# EAGLE design v.0.0.1 (EAGLE 5.11)

## Sheet 1 of 4
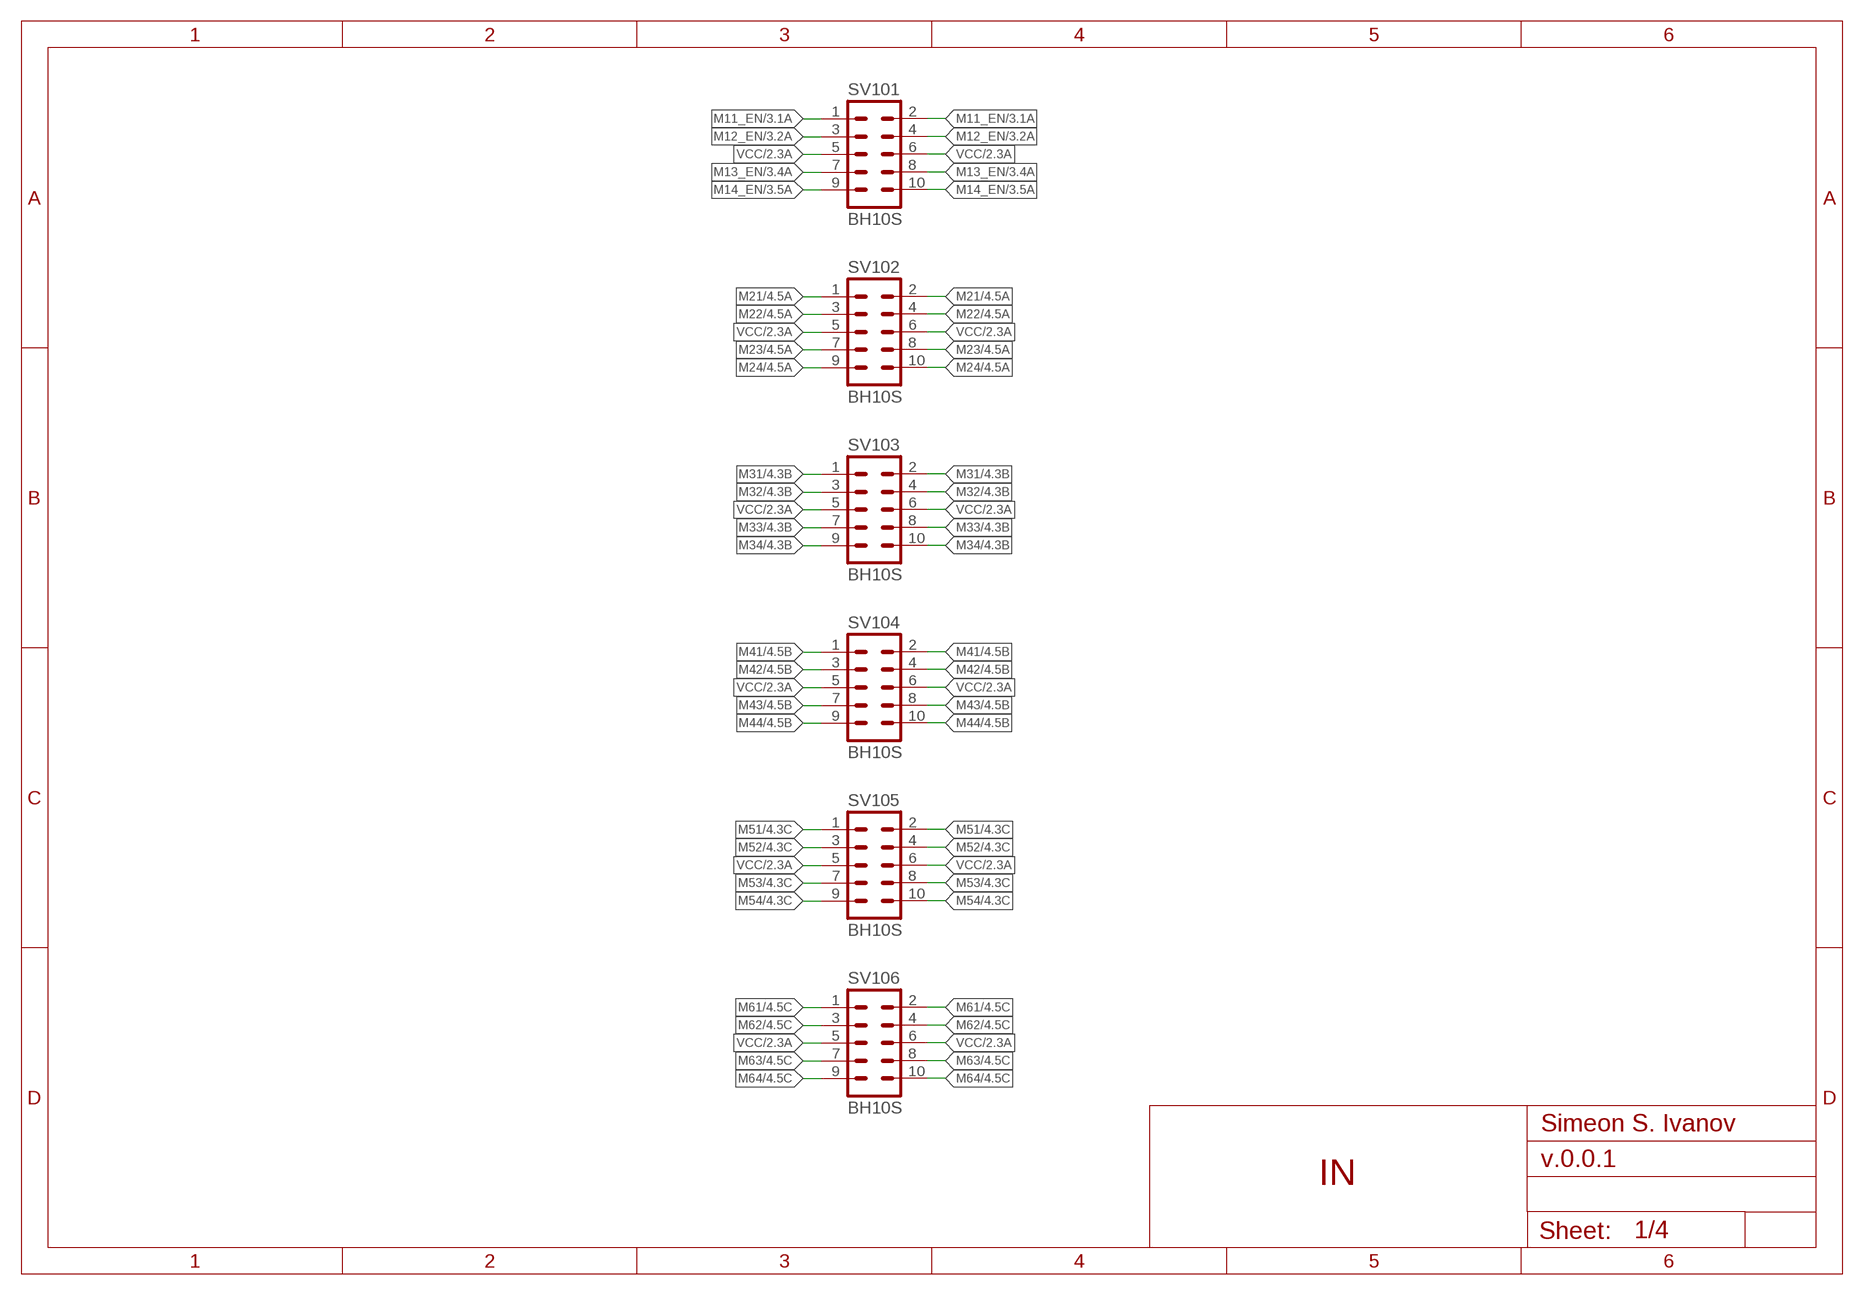
[diagram p0: schematic, sheet 1]

### Parts
SV101  BH10S  ML10M10-HOME  [M10-HOME]
SV102  BH10S  ML10M10-HOME  [M10-HOME]
SV103  BH10S  ML10M10-HOME  [M10-HOME]
SV104  BH10S  ML10M10-HOME  [M10-HOME]
SV105  BH10S  ML10M10-HOME  [M10-HOME]
SV106  BH10S  ML10M10-HOME  [M10-HOME]

### Nets
M11_EN: SV101.1 SV101.2 ; also sheet 3
M12_EN: SV101.3 SV101.4 ; also sheet 3
M13_EN: SV101.7 SV101.8 ; also sheet 3
M14_EN: SV101.9 SV101.10 ; also sheet 3
M21: SV102.1 SV102.2 ; also sheet 4
M22: SV102.3 SV102.4 ; also sheet 4
M23: SV102.7 SV102.8 ; also sheet 4
M24: SV102.9 SV102.10 ; also sheet 4
M31: SV103.1 SV103.2 ; also sheet 4
M32: SV103.3 SV103.4 ; also sheet 4
M33: SV103.7 SV103.8 ; also sheet 4
M34: SV103.9 SV103.10 ; also sheet 4
M41: SV104.1 SV104.2 ; also sheet 4
M42: SV104.3 SV104.4 ; also sheet 4
M43: SV104.7 SV104.8 ; also sheet 4
M44: SV104.9 SV104.10 ; also sheet 4
M51: SV105.1 SV105.2 ; also sheet 4
M52: SV105.3 SV105.4 ; also sheet 4
M53: SV105.7 SV105.8 ; also sheet 4
M54: SV105.9 SV105.10 ; also sheet 4
M61: SV106.1 SV106.2 ; also sheet 4
M62: SV106.3 SV106.4 ; also sheet 4
M63: SV106.7 SV106.8 ; also sheet 4
M64: SV106.9 SV106.10 ; also sheet 4
VCC: SV101.5 SV101.6 SV102.5 SV102.6 SV103.5 SV103.6 SV104.5 SV104.6 SV105.5 SV105.6 SV106.5 SV106.6 ; also sheet 2

### Notes on the sheet
- Simeon S. Ivanov
- IN

## Sheet 2 of 4
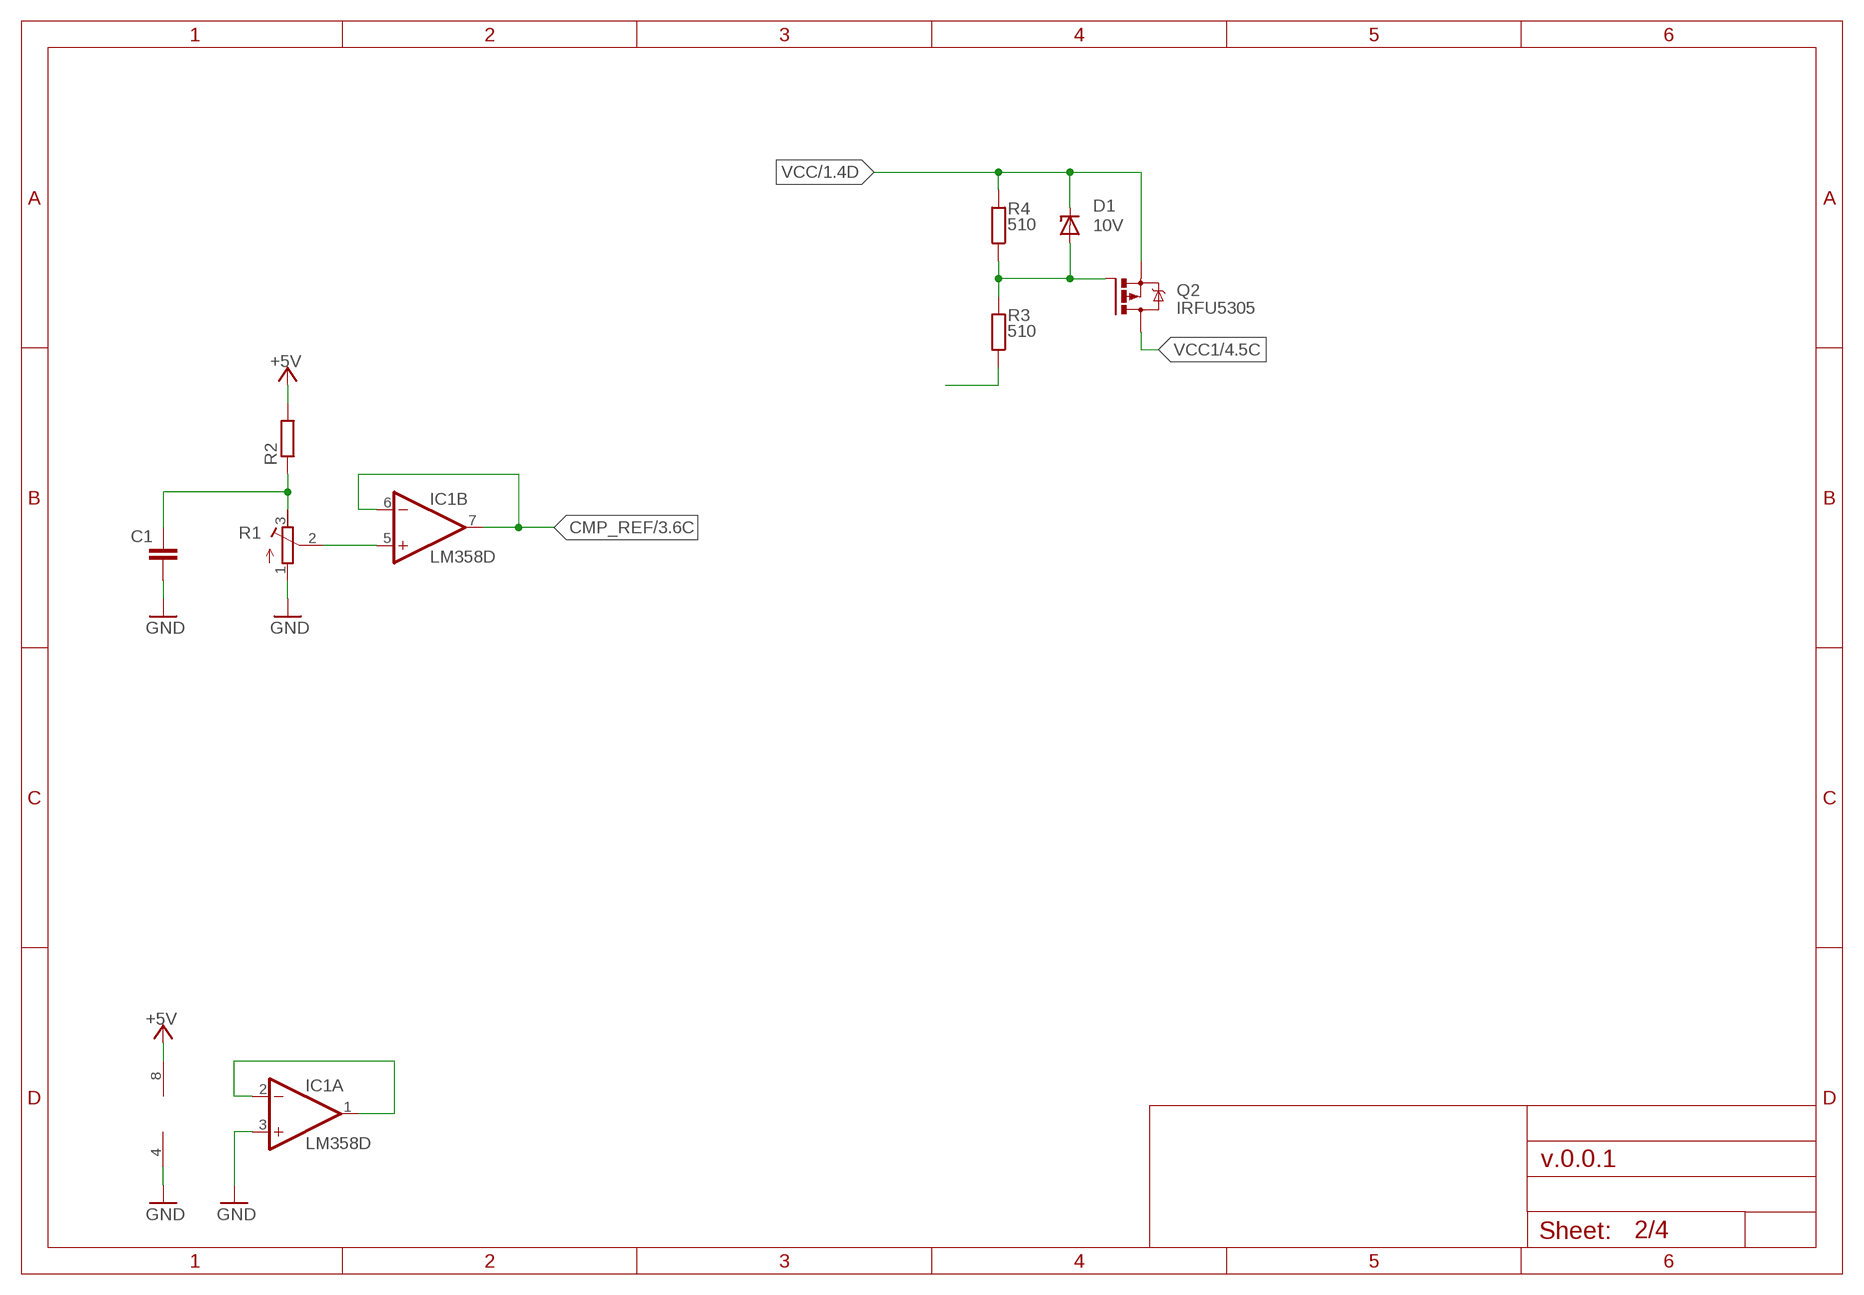
[diagram p1: schematic, sheet 2]

### Parts
C1  C-EUC1206  [C1206]
D1  10V  ZENER-DIODEZD-5  [ZDIO-5]
IC1  LM358D  [SO08]
Q2  IRFU5305  [I-PAK_TO251AA]
R1  R-TRIMM3296W  [RTRIM3296W]
R2  R-EU_0204/5  [0204/5]
R3  510  R-EU_0204/5  [0204/5]
R4  510  R-EU_0204/5  [0204/5]

### Nets
+5V: IC1.8(P:V+) R2.2 ; also sheet 3
CMP_REF: IC1.6(B:-IN) IC1.7(B:OUT) ; also sheet 3
GND: C1.2 IC1.3(A:+IN) IC1.4(P:V-) R1.1(E) ; also sheet 3,4
N$6: C1.1 R1.3(A) R2.1
N$17: IC1.5(B:+IN) R1.2(S)
N$18: IC1.1(A:OUT) IC1.2(A:-IN)
N$23: D1.A Q2.1(G) R3.2 R4.1
N$24: R3.1
VCC: D1.C Q2.3(S) R4.2 ; also sheet 1
VCC1: Q2.2(D) ; also sheet 4

## Sheet 3 of 4
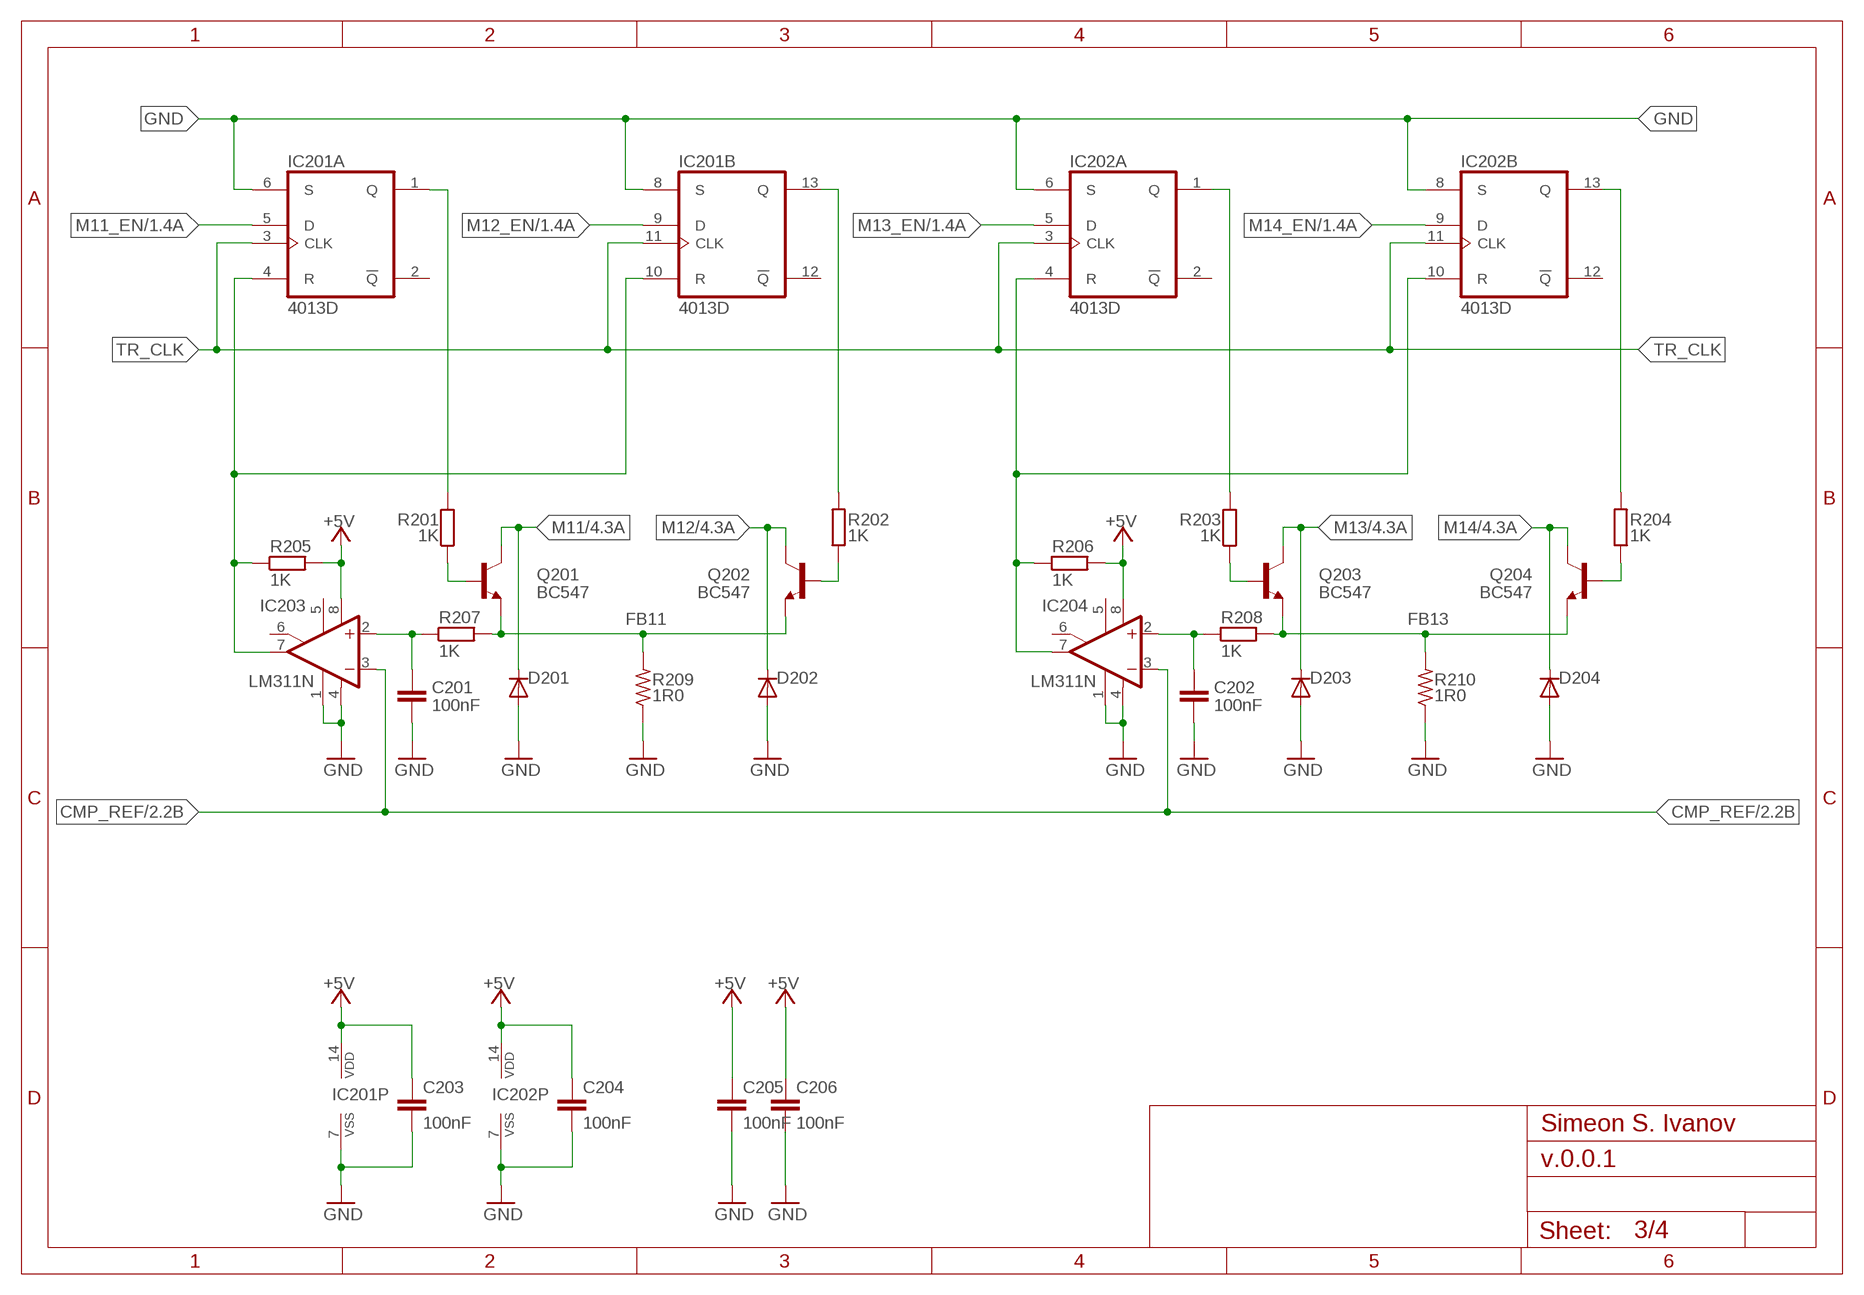
[diagram p2: schematic, sheet 3]

### Parts
C201  100nF  C-EUC1206  [C1206]
C202  100nF  C-EUC1206  [C1206]
C203  100nF  C-EUC0603  [C0603]
C204  100nF  C-EUC0603  [C0603]
C205  100nF  C-EUC0603  [C0603]
C206  100nF  C-EUC0603  [C0603]
D201  DIODE-D-7.5  [D-7.5]
D202  DIODE-D-2.5  [D-2.5]
D203  DIODE-D-5  [D-5]
D204  DIODE-D-5  [D-5]
IC201  4013D  [SO14]
IC202  4013D  [SO14]
IC203  LM311N  [DIL08]
IC204  LM311N  [DIL08]
Q201  BC547  [TO92]
Q202  BC547  [TO92]
Q203  BC547  [TO92]
Q204  BC547  [TO92]
R201  1K  R-EU_0204/5  [0204/5]
R202  1K  R-EU_0204/5  [0204/5]
R203  1K  R-EU_0204/5  [0204/5]
R204  1K  R-EU_0204/5  [0204/5]
R205  1K  R-EU_R0603  [R0603]
R206  1K  R-EU_R0603  [R0603]
R207  1K  R-EU_0204/5  [0204/5]
R208  1K  R-EU_0204/2V  [0204V]
R209  1R0  R-US_0204/5  [0204/5]
R210  1R0  R-US_0204/5  [0204/5]

### Nets
+5V: C203.1 C204.1 C205.1 C206.1 IC201.14(P:VDD) IC202.14(P:VDD) IC203.8(V+) IC204.8(V+) R205.2 R206.2 ; also sheet 2
CMP_REF: IC203.3(-IN) IC204.3(-IN) ; also sheet 2
FB11: Q201.1(E) Q202.1(E) R207.2 R209.2
FB13: Q203.1(E) Q204.1(E) R208.2 R210.2
GND: C201.2 C202.2 C203.2 C204.2 C205.2 C206.2 D201.A D202.A D203.A D204.A IC201.6(A:S) IC201.7(P:VSS) IC201.8(B:S) IC202.6(A:S) IC202.7(P:VSS) IC202.8(B:S) IC203.1(GND) IC203.4(V-) IC204.1(GND) IC204.4(V-) R209.1 R210.1 ; also sheet 2,4
M11: D201.C Q201.3(C) ; also sheet 4
M11_EN: IC201.5(A:D) ; also sheet 1
M12: D202.C Q202.3(C) ; also sheet 4
M12_EN: IC201.9(B:D) ; also sheet 1
M13: D203.C Q203.3(C) ; also sheet 4
M13_EN: IC202.5(A:D) ; also sheet 1
M14: D204.C Q204.3(C) ; also sheet 4
M14_EN: IC202.9(B:D) ; also sheet 1
N$7: Q201.2(B) R201.1
N$8: IC201.13(B:Q) R202.2
N$9: IC201.1(A:Q) R201.2
N$10: IC201.4(A:R) IC201.10(B:R) IC203.7(OUT) R205.1
N$11: Q202.2(B) R202.1
N$12: Q204.2(B) R204.1
N$13: Q203.2(B) R203.1
N$14: IC202.13(B:Q) R204.2
N$15: IC202.4(A:R) IC202.10(B:R) IC204.7(OUT) R206.1
N$16: IC202.1(A:Q) R203.2
N$19: C202.1 IC204.2(+IN) R208.1
N$22: C201.1 IC203.2(+IN) R207.1
TR_CLK: IC201.3(A:CLK) IC201.11(B:CLK) IC202.3(A:CLK) IC202.11(B:CLK)
Unconnected: IC201.2(A:!Q) IC201.12(B:!Q) IC202.2(A:!Q) IC202.12(B:!Q) IC203.5(ON) IC203.6(ON/STR) IC204.5(ON) IC204.6(ON/STR)

### Notes on the sheet
- Simeon S. Ivanov

## Sheet 4 of 4
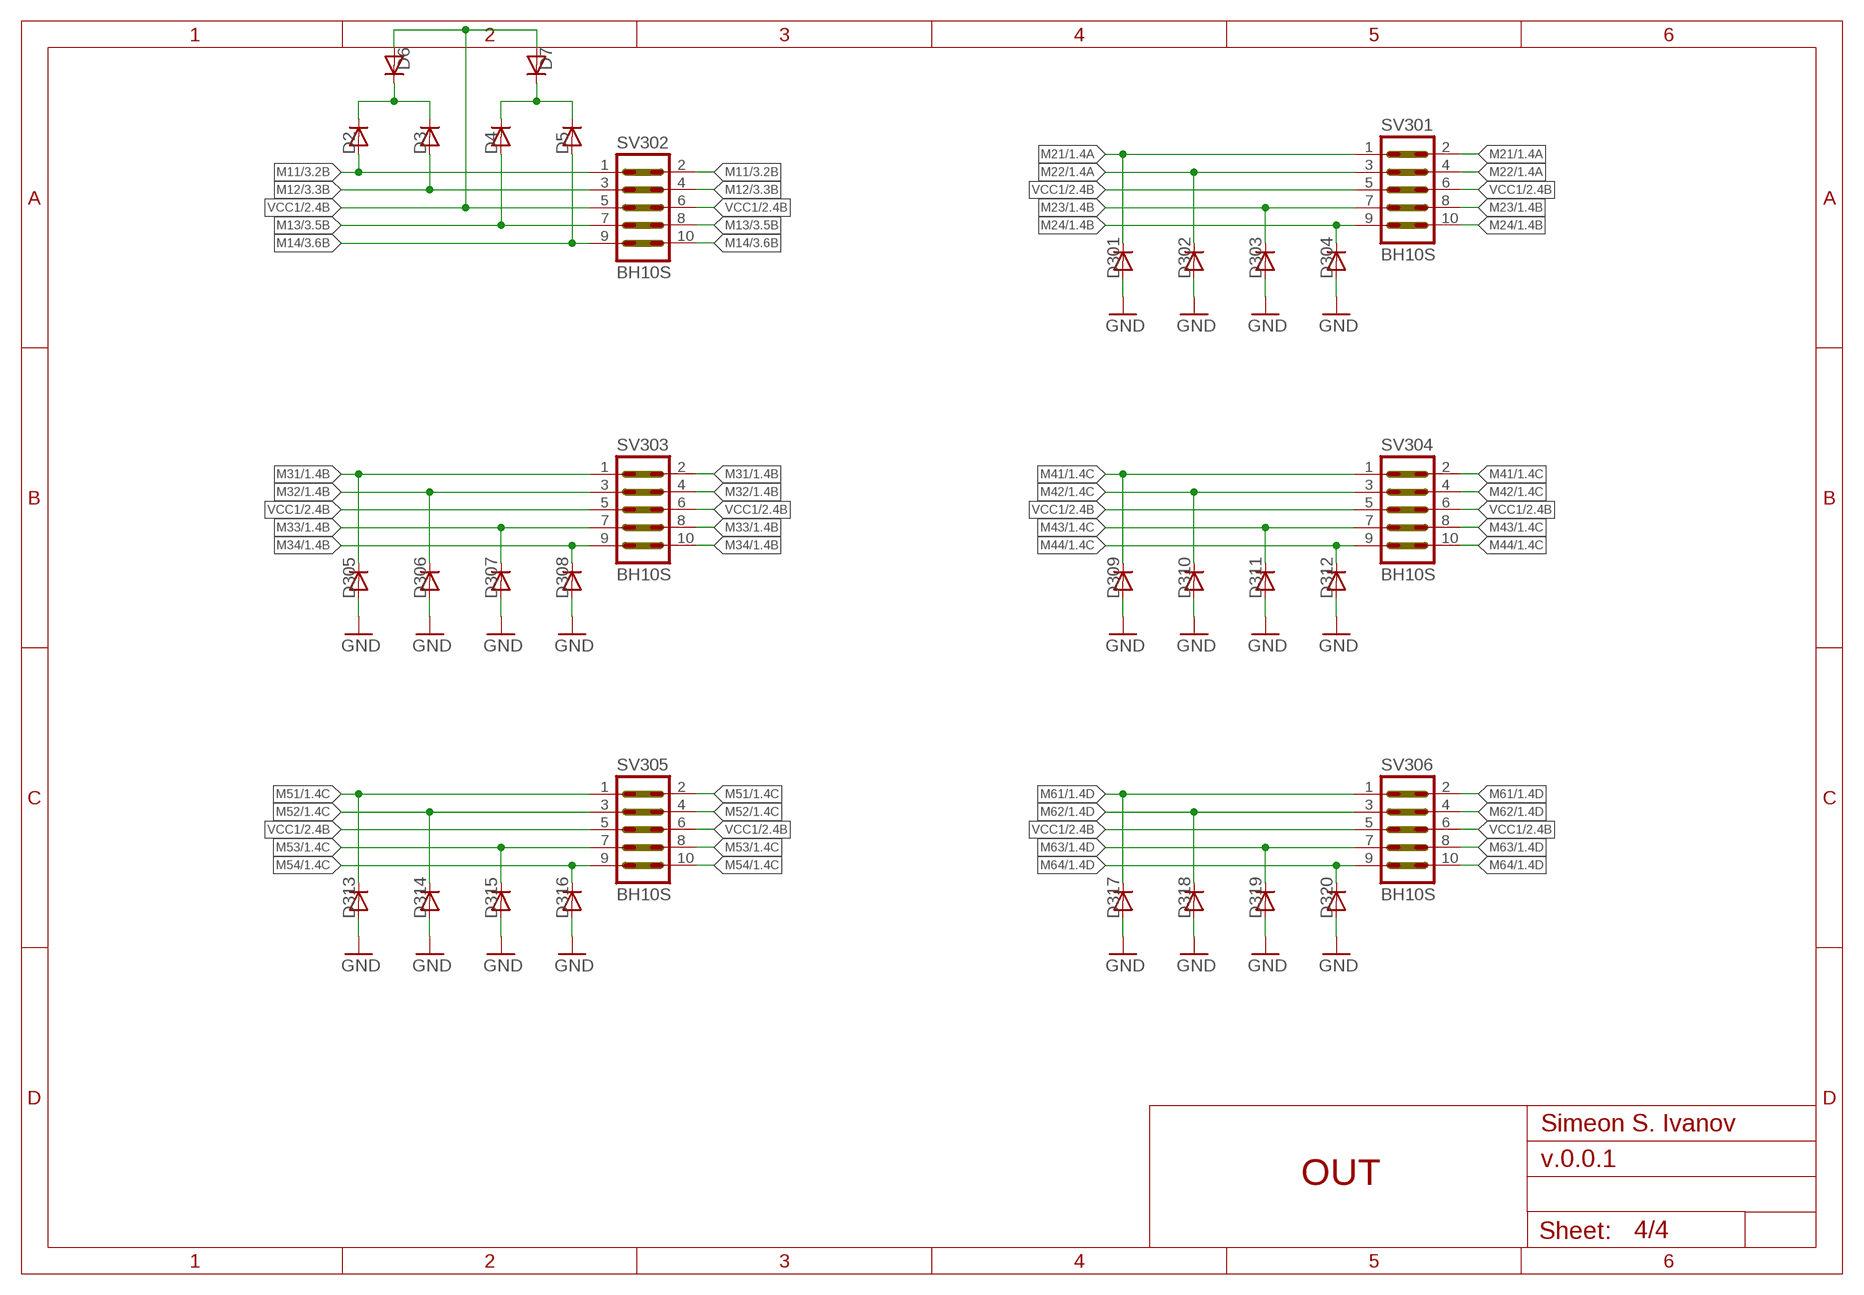
[diagram p3: schematic, sheet 4]

### Parts
D2  DIODE-D-2.5  [D-2.5]
D3  DIODE-D-2.5  [D-2.5]
D4  DIODE-D-2.5  [D-2.5]
D5  DIODE-D-2.5  [D-2.5]
D6  DIODE-D-2.5  [D-2.5]
D7  DIODE-D-2.5  [D-2.5]
D301  DIODE-D-2.5  [D-2.5]
D302  DIODE-D-2.5  [D-2.5]
D303  DIODE-D-2.5  [D-2.5]
D304  DIODE-D-2.5  [D-2.5]
D305  DIODE-D-2.5  [D-2.5]
D306  DIODE-D-2.5  [D-2.5]
D307  DIODE-D-2.5  [D-2.5]
D308  DIODE-D-2.5  [D-2.5]
D309  DIODE-D-2.5  [D-2.5]
D310  DIODE-D-2.5  [D-2.5]
D311  DIODE-D-2.5  [D-2.5]
D312  DIODE-D-2.5  [D-2.5]
D313  DIODE-D-2.5  [D-2.5]
D314  DIODE-D-2.5  [D-2.5]
D315  DIODE-D-2.5  [D-2.5]
D316  DIODE-D-2.5  [D-2.5]
D317  DIODE-D-2.5  [D-2.5]
D318  DIODE-D-2.5  [D-2.5]
D319  DIODE-D-2.5  [D-2.5]
D320  DIODE-D-2.5  [D-2.5]
SV301  BH10S  ML10M10-HOME  [M10-HOME]
SV302  BH10S  ML10M10-HOME  [M10-HOME]
SV303  BH10S  ML10M10-HOME  [M10-HOME]
SV304  BH10S  ML10M10-HOME  [M10-HOME]
SV305  BH10S  ML10M10-HOME  [M10-HOME]
SV306  BH10S  ML10M10-HOME  [M10-HOME]

### Nets
GND: D301.A D302.A D303.A D304.A D305.A D306.A D307.A D308.A D309.A D310.A D311.A D312.A D313.A D314.A D315.A D316.A D317.A D318.A D319.A D320.A ; also sheet 2,3
M11: D2.A SV302.1 SV302.2 ; also sheet 3
M12: D3.A SV302.3 SV302.4 ; also sheet 3
M13: D4.A SV302.7 SV302.8 ; also sheet 3
M14: D5.A SV302.9 SV302.10 ; also sheet 3
M21: D301.C SV301.1 SV301.2 ; also sheet 1
M22: D302.C SV301.3 SV301.4 ; also sheet 1
M23: D303.C SV301.7 SV301.8 ; also sheet 1
M24: D304.C SV301.9 SV301.10 ; also sheet 1
M31: D305.C SV303.1 SV303.2 ; also sheet 1
M32: D306.C SV303.3 SV303.4 ; also sheet 1
M33: D307.C SV303.7 SV303.8 ; also sheet 1
M34: D308.C SV303.9 SV303.10 ; also sheet 1
M41: D309.C SV304.1 SV304.2 ; also sheet 1
M42: D310.C SV304.3 SV304.4 ; also sheet 1
M43: D311.C SV304.7 SV304.8 ; also sheet 1
M44: D312.C SV304.9 SV304.10 ; also sheet 1
M51: D313.C SV305.1 SV305.2 ; also sheet 1
M52: D314.C SV305.3 SV305.4 ; also sheet 1
M53: D315.C SV305.7 SV305.8 ; also sheet 1
M54: D316.C SV305.9 SV305.10 ; also sheet 1
M61: D317.C SV306.1 SV306.2 ; also sheet 1
M62: D318.C SV306.3 SV306.4 ; also sheet 1
M63: D319.C SV306.7 SV306.8 ; also sheet 1
M64: D320.C SV306.9 SV306.10 ; also sheet 1
N$20: D2.C D3.C D6.C
N$25: D4.C D5.C D7.C
VCC1: D6.A D7.A SV301.5 SV301.6 SV302.5 SV302.6 SV303.5 SV303.6 SV304.5 SV304.6 SV305.5 SV305.6 SV306.5 SV306.6 ; also sheet 2

### Notes on the sheet
- Simeon S. Ivanov
- OUT

## Library data of the parts
C1 C201-C206 = rcl:C-EU: CAPACITOR, European symbol
D1 = diode:ZENER-DIODE: Z-Diode
D2-D7 D201-D204 D301-D320 = diode:DIODE-: DIODE
IC1 = linear:LM358: OP AMP also LM158; LM258; LM2904 Source: http://cache.national.com/ds/LM/LM158.pdf
IC201 IC202 = 40xx:4013: Dual D FLIP FLOP, set/reset
IC203 IC204 = linear:LM311: COMPARATOR
Q2 = transistor-power:IRF?5305: HEXFET Power MOSFET Source: http://www.irf.com/product-info/datasheets/data/irfr5305pbf.pdf
Q201-Q204 = transistor-npn:BC547*: NPN Transistor
R1 = rcl:R-TRIMM: Trimm resistor
R2-R4 R201-R208 = rcl:R-EU_: RESISTOR, European symbol
R209 R210 = rcl:R-US_: RESISTOR, American symbol
SV101-SV106 SV301-SV306 = con-harting-ml:ML10: HARTING

## Board
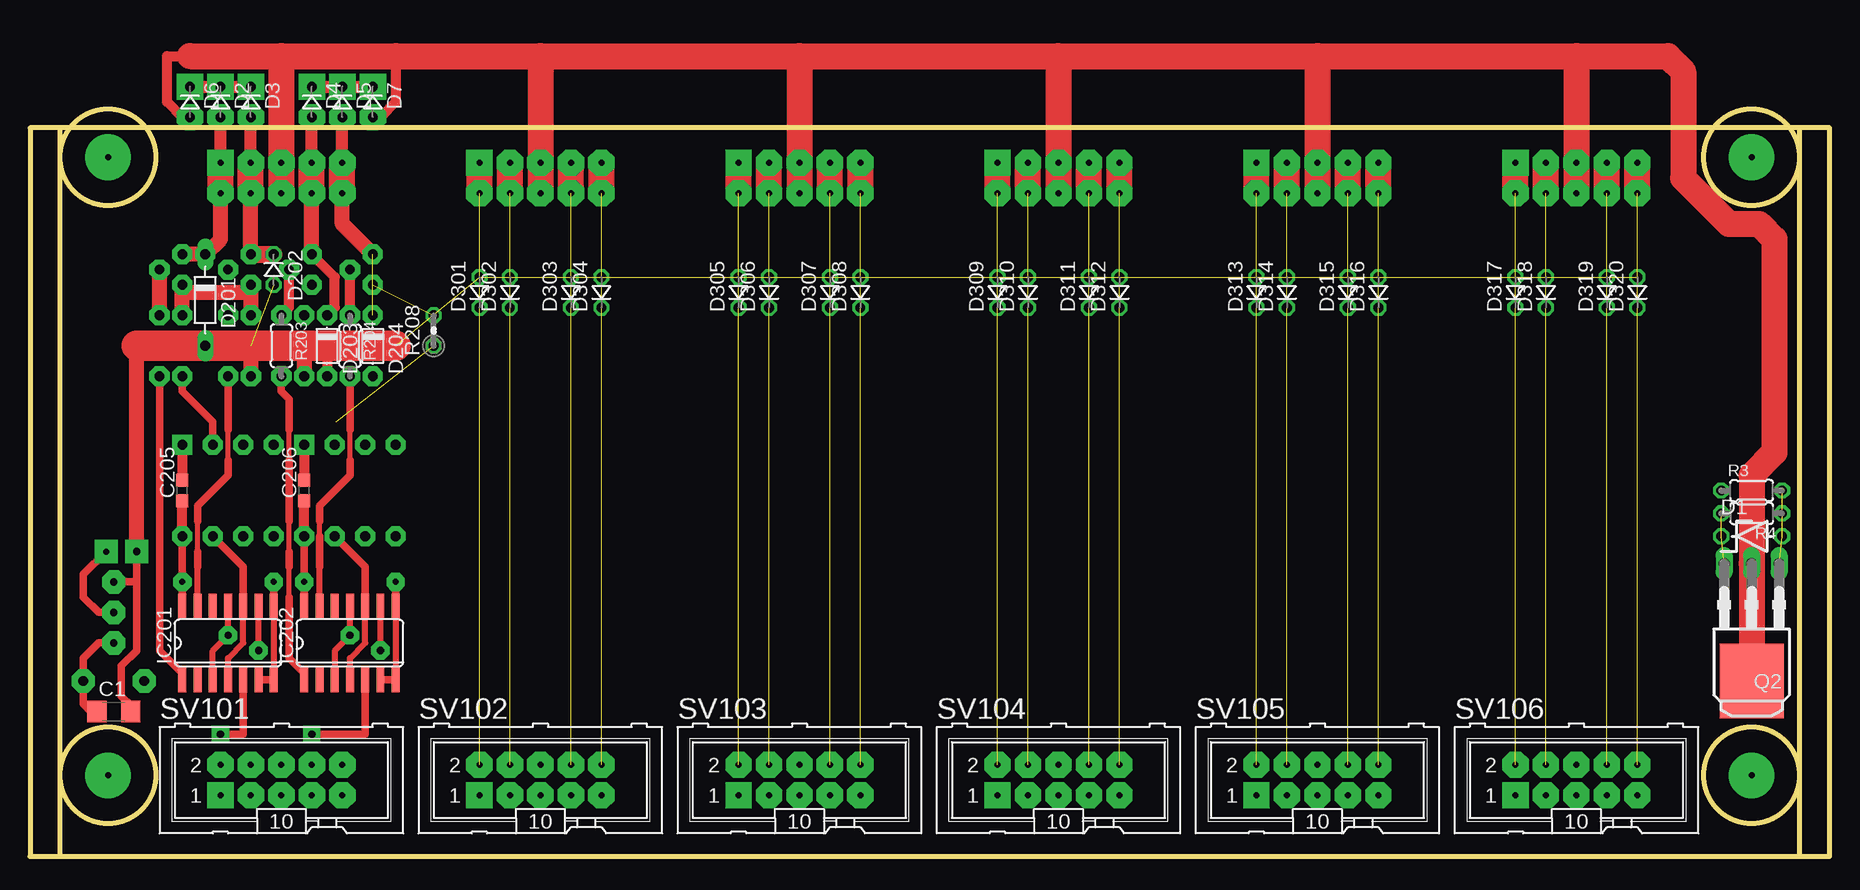
[diagram p4: board, top side]
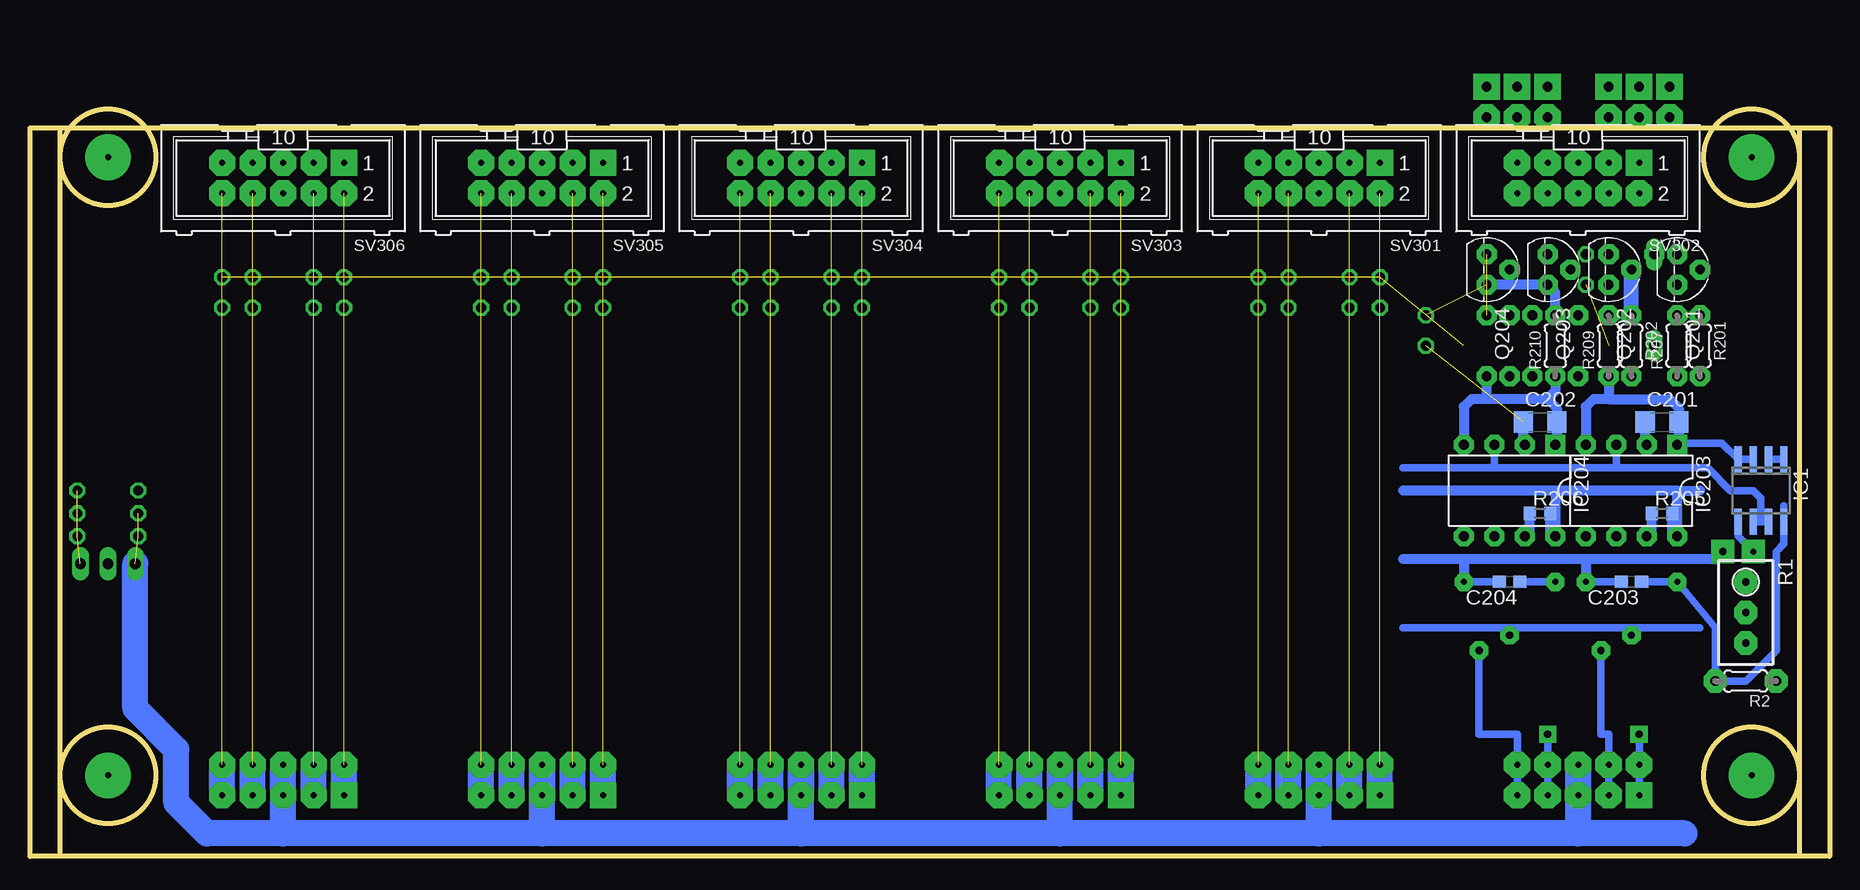
[diagram p5: board, bottom side, seen from below]

Size 150 x 62.25 mm. Coordinates in mm from the lower left corner, seen from the top.
Outline: 147.5,60.71 150,60.71 150,0 0,0 0,60.71 2.5,60.71
Outline: 147.5,60.71 2.5,60.71
Outline: 2.5,0.1 2.5,60.71
Outline: 147.5,0.1 147.5,60.71
Outline: circle at 6.5,6.75 radius 4
Outline: circle at 143.5,6.75 radius 4
Outline: circle at 6.5,58.25 radius 4
Outline: circle at 143.5,58.25 radius 4
Copper layers (1*16): Top 0.035mm / dielectric 1.5mm / Bottom 0.035mm
Design rules "default *": minimum track width 10mil, minimum drill 19mil, track to track 8mil, track to pad 8mil, pad to pad 8mil, via to via 8mil, smd to smd 8mil, copper to edge 40mil, drill to drill 8mil, minimum pad ring 10mil, minimum via ring 8mil, stop-mask expansion 4mil, vias tented up to drill 0mil, thermal gap 10mil

### Footprints (pad centres in the part's own frame; a part is rotated, then mirrored left to right if it is on the bottom)
C1206 = smd 1.6 x 1.8: 1 -1.4,0; 2 1.4,0
C0603 = smd 1.1 x 1: 1 -0.85,0; 2 0.85,0
ZDIO-5 = drill 0.813 octagon: A 2.54,0; C -2.54,0
D-2.5 = drill 0.813 octagon: A 1.27,0; C -1.27,0
D-7.5 = drill 0.813 long: A 3.81,0; C -3.81,0
D-5 = drill 0.813 octagon: A 2.54,0; C -2.54,0
SO08 = smd 0.6 x 2.2: 1 -1.905,-2.6; 2 -0.635,-2.6; 3 0.635,-2.6; 4 1.905,-2.6; 5 1.905,2.6; 6 0.635,2.6; 7 -0.635,2.6; 8 -1.905,2.6
SO14 = smd 0.66 x 2.032: 1 -3.81,-3.073; 2 -2.54,-3.073; 3 -1.27,-3.073; 4 0,-3.073; 5 1.27,-3.073; 6 2.54,-3.073; 7 3.81,-3.073; 8 3.81,3.073; 9 2.54,3.073; 10 1.27,3.073; 11 0,3.073; 12 -1.27,3.073; 13 -2.54,3.073; 14 -3.81,3.073
DIL08 = drill 0.813 pad 1.27 round: 1 -3.81,-3.81; 2 -1.27,-3.81; 3 1.27,-3.81; 4 3.81,-3.81; 5 3.81,3.81; 6 1.27,3.81; 7 -1.27,3.81; 8 -3.81,3.81
I-PAK_TO251AA = drill 0.889 long: 1 -2.286,-5.334; 2 0,-5.334; 3 2.286,-5.334 | smd 5.334 x 6.223: 4 0,4.445
TO92 = drill 0.813 octagon: 1 1.27,0; 2 0,1.905; 3 -1.27,0
RTRIM3296W = drill 0.61 round: 1 0,-2.54; 2 0,0; 3 0,2.54
0204/5 = drill 0.813 octagon: 1 -2.54,0; 2 2.54,0
R0603 = smd 1 x 1.1: 1 -0.85,0; 2 0.85,0
0204V = drill 0.813 octagon: 1 -1.27,0; 2 1.27,0
M10-HOME = drill 0.5 pad 2.184 square: 1 -5.08,-1.27 | drill 0.5 pad 2.184 octagon: 2 -5.08,1.27; 3 -2.54,-1.27; 4 -2.54,1.27; 5 0,-1.27; 6 0,1.27; 7 2.54,-1.27; 8 2.54,1.27; 9 5.08,-1.27; 10 5.08,1.27

### Placement (x,y rotation side)
C1  6.99,12.06 0 top
C201  13.97,36.2 0 bottom
C202  24.13,36.2 0 bottom
C203  16.51,22.86 180 bottom
C204  26.67,22.86 180 bottom
C205  12.7,30.48 90 top
C206  22.86,30.48 90 top
D1  143.51,26.67 0 top
D2  15.88,62.87 270 top
D3  18.41,62.87 270 top
D4  23.5,62.87 270 top
D5  26.04,62.87 270 top
D6  13.34,62.87 270 top
D7  28.57,62.87 270 top
D201  14.61,46.35 270 top
D202  20.32,48.9 270 top
D203  24.77,42.55 270 top
D204  28.57,42.55 270 top
D301  37.47,46.99 90 top
D302  40.01,46.99 90 top
D303  45.09,46.99 90 top
D304  47.62,46.99 90 top
D305  59.05,46.99 90 top
D306  61.59,46.99 90 top
D307  66.67,46.99 90 top
D308  69.22,46.99 90 top
D309  80.64,46.99 90 top
D310  83.19,46.99 90 top
D311  88.27,46.99 90 top
D312  90.81,46.99 90 top
D313  102.23,46.99 90 top
D314  104.78,46.99 90 top
D315  109.86,46.99 90 top
D316  112.39,46.99 90 top
D317  123.83,46.99 90 top
D318  126.36,46.99 90 top
D319  131.44,46.99 90 top
D320  133.99,46.99 90 top
IC1  5.71,30.48 180 bottom
IC201  16.51,17.78 0 top
IC202  26.67,17.78 0 top
IC203  16.51,30.48 180 bottom
IC204  26.67,30.48 180 bottom
Q2  143.51,19.05 180 top
Q201  12.7,48.9 270 bottom
Q202  18.41,48.9 270 bottom
Q203  23.5,48.9 270 bottom
Q204  28.57,48.9 270 bottom
R1  6.99,20.32 180 bottom
R2  6.99,14.61 180 bottom
R3  143.51,30.48 0 top
R4  143.51,28.57 180 top
R201  10.79,42.55 270 bottom
R202  16.51,42.55 270 bottom
R203  20.95,42.55 270 top
R204  26.67,42.55 270 top
R205  13.97,28.57 0 bottom
R206  24.13,28.57 0 bottom
R207  12.7,42.55 90 bottom
R208  33.66,43.81 90 top
R209  18.41,42.55 90 bottom
R210  22.86,42.55 90 bottom
SV101  20.95,6.35 0 top
SV102  42.55,6.35 0 top
SV103  64.14,6.35 0 top
SV104  85.72,6.35 0 top
SV105  107.31,6.35 0 top
SV106  128.91,6.35 0 top
SV301  42.55,56.52 180 bottom
SV302  20.95,56.52 180 bottom
SV303  64.14,56.52 180 bottom
SV304  85.72,56.52 180 bottom
SV305  107.31,56.52 180 bottom
SV306  128.91,56.52 180 bottom

### Tracks (layer width: path | path; a pad name or v marks a point on that pad's centre or on a via)
+5V  (via drill 0.5 pad 1.52, 0.5 pad 1.68, 0.5 pad 1.93)
  Top 0.61: IC201.14 v12.7,22.86 IC203.8 | IC204.8 v22.86,22.86 IC202.14
  Top 0.813: IC203.8 C205.1 | IC204.8 C206.1
  Bottom 0.61: C203.1 v12.7,22.86 9.53,19.05 R2.2 6.99,14.61 4.45,17.14 4.45,25.4 3.81,26.04 IC1.8 3.81,29.21 | v22.86,22.86 C204.1
  Bottom 0.813: R205.2 13.12,27.09 IC203.8 12.7,30.48 | R206.2 23.28,27.09 IC204.8 22.86,30.48 | 12.7,30.48 10.79,30.48 | 12.7,30.48 22.86,30.48 | 22.86,30.48 35.56,30.48
  other vias: 12.7,26.67 22.86,26.67 9.53,14.61
CMP_REF  (via drill 0.5 pad 1.68)
  Bottom 0.61: 17.78,32.38 IC203.3 | 17.78,32.38 10.16,32.38 8.26,30.48 6.35,30.48 5.71,29.84 5.71,27.88 | 17.78,32.38 27.94,32.38 | 27.94,32.38 35.56,32.38 | 27.94,32.38 IC204.3 | IC1.7 5.71,27.88 | 5.71,27.88 IC1.6
  other vias: 17.78,34.29 27.94,34.29
FB11  (via drill 0.5 pad 1.68)
  Top 1.27: R207.2 12.7,46.99 | 12.7,46.99 Q201.1 | 12.7,46.99 18.41,46.99 | 18.41,46.99 Q202.1 | 18.41,46.99 R209.2
  other vias: 18.41,47.62 12.7,47.62 18.41,45.09 12.7,45.09
FB13  (via drill 0.5 pad 1.68)  (1 unrouted)
  Bottom 0.813: Q204.1 Q203.1 22.86,46.99 R210.2
  other vias: 23.5,47.62 28.57,47.62 22.86,45.09
GND  (via drill 0.5 pad 1.42, 0.5 pad 1.52, 0.5 pad 1.68, 0.5 pad 1.93, 0.6 pad 1.93)  (21 unrouted)
  Top 0.508: IC201.8 IC201.7 | IC202.8 IC202.7
  Top 0.61: IC201.7 IC201.6 | IC202.7 IC202.6 | v20.32,22.86 IC201.8 | v30.48,22.86 IC202.8 | C1.2 8.38,12.57 7.62,13.34 7.62,15.88 8.89,17.14 8.89,22.86 | 8.89,22.86 v8.89,25.4 | 8.89,22.86 R1.1
  Top 0.813: IC203.1 C205.2 | IC204.1 C206.2 | 24.77,42.55 D203.A
  Top 1.27: v8.89,25.4 8.89,42.55 | 18.41,42.55 R209.1 | 22.86,42.55 R210.1
  Top 2.54: 8.89,42.55 D201.A 18.41,42.55 22.86,42.55 24.77,42.55 30.48,42.55
  Bottom 0.61: v20.32,22.86 C203.2 | v30.48,22.86 C204.2 | 12.57,34.42 8.96,34.42 IC1.4 IC1.3
  Bottom 0.813: 18.41,38.1 19.68,38.1 20.32,37.47 IC203.4 | R209.1 18.41,38.1 | IC203.1 12.57,34.42 C201.2 12.57,37.34 13.34,38.1 18.41,38.1 | 28.57,38.1 29.84,38.1 30.48,37.47 IC204.4 | 28.57,38.1 D204.A | 20.32,24.77 v20.32,22.86 | 20.32,24.77 30.48,24.77 | 30.48,24.77 35.56,24.77 | 30.48,24.77 v30.48,22.86 | v8.89,25.4 9.53,24.77 20.32,24.77 | 23.5,38.1 22.73,37.34 C202.2 22.73,34.42 IC204.1 | 23.5,38.1 28.57,38.1 | R210.1 22.86,38.73 23.5,38.1
  other vias: 12.7,34.29 22.86,34.29 18.41,40.01 22.86,40.01 24.77,40.01 28.57,40.01 30.48,34.29 30.48,34.29 20.32,34.29 6.99,22.86
M11  (via drill 0.5 pad 1.68, 0.5 pad 2.18)
  Top 1.016: SV302.1 D2.A
  Top 1.27: SV302.2 15.88,51.44 D201.C v12.7,50.16
  Top 2.184: SV302.2 SV302.1
  other vias: 14.61,50.16 15.88,61.59
M11_EN  (via drill 0.6 pad 1.42)
  Top 0.61: v15.88,10.16 17.78,10.16 IC201.5
  Bottom 0.61: SV101.1 SV101.2 v15.88,10.16
M12  (via drill 0.5 pad 1.68, 0.5 pad 2.18)
  Top 1.016: SV302.3 D3.A
  Top 1.27: v18.41,50.16 SV302.4
  Top 1.422: v18.41,50.16 D202.C
  Top 2.184: SV302.4 SV302.3
  other vias: 18.41,61.59
M12_EN  (via drill 0.6 pad 1.52)
  Top 0.508: v19.05,17.14 IC201.9
  Bottom 0.61: v19.05,17.14 19.05,10.16 18.41,10.16 SV101.4 SV101.3
M13  (via drill 0.5 pad 1.68, 0.5 pad 2.18)
  Top 0.813: D203.C 25.4,45.72 25.4,48.26 v23.5,50.16
  Top 1.016: SV302.7 D4.A
  Top 1.27: v23.5,50.16 SV302.8
  Top 2.184: SV302.8 SV302.7
  other vias: 24.77,45.09 23.5,61.59
M13_EN  (via drill 0.6 pad 1.42)
  Top 0.61: v23.5,10.16 27.94,10.16 IC202.5
  Bottom 0.61: SV101.7 SV101.8 v23.5,10.16
M14  (via drill 0.5 pad 1.68, 0.5 pad 2.18)  (1 unrouted)
  Top 1.016: SV302.9 D5.A
  Top 1.27: SV302.10 26.04,52.7 v28.57,50.16
  Top 2.184: SV302.10 SV302.9
  other vias: 28.57,45.09 26.04,61.59
M14_EN  (via drill 0.6 pad 1.52)
  Top 0.508: v29.21,17.14 IC202.9
  Bottom 0.61: v29.21,17.14 29.21,10.16 26.04,10.16 SV101.10 SV101.9
M21  (2 unrouted)
  Top 2.184: SV301.2 SV301.1
  Bottom 2.184: SV102.1 SV102.2
M22  (2 unrouted)
  Top 2.184: SV301.4 SV301.3
  Bottom 2.184: SV102.3 SV102.4
M23  (2 unrouted)
  Top 2.184: SV301.8 SV301.7
  Bottom 2.184: SV102.7 SV102.8
M24  (2 unrouted)
  Top 2.184: SV301.10 SV301.9
  Bottom 2.184: SV102.9 SV102.10
M31  (2 unrouted)
  Top 2.184: SV303.2 SV303.1
  Bottom 2.184: SV103.1 SV103.2
M32  (2 unrouted)
  Top 2.184: SV303.4 SV303.3
  Bottom 2.184: SV103.3 SV103.4
M33  (2 unrouted)
  Top 2.184: SV303.8 SV303.7
  Bottom 2.184: SV103.7 SV103.8
M34  (2 unrouted)
  Top 2.184: SV303.10 SV303.9
  Bottom 2.184: SV103.9 SV103.10
M41  (2 unrouted)
  Top 2.184: SV304.2 SV304.1
  Bottom 2.184: SV104.1 SV104.2
M42  (2 unrouted)
  Top 2.184: SV304.4 SV304.3
  Bottom 2.184: SV104.3 SV104.4
M43  (2 unrouted)
  Top 2.184: SV304.8 SV304.7
  Bottom 2.184: SV104.7 SV104.8
M44  (2 unrouted)
  Top 2.184: SV304.10 SV304.9
  Bottom 2.184: SV104.9 SV104.10
M51  (2 unrouted)
  Top 2.184: SV305.2 SV305.1
  Bottom 2.184: SV105.1 SV105.2
M52  (2 unrouted)
  Top 2.184: SV305.4 SV305.3
  Bottom 2.184: SV105.3 SV105.4
M53  (2 unrouted)
  Top 2.184: SV305.8 SV305.7
  Bottom 2.184: SV105.7 SV105.8
M54  (2 unrouted)
  Top 2.184: SV305.10 SV305.9
  Bottom 2.184: SV105.9 SV105.10
M61  (2 unrouted)
  Top 2.184: SV306.2 SV306.1
  Bottom 2.184: SV106.1 SV106.2
M62  (2 unrouted)
  Top 2.184: SV306.4 SV306.3
  Bottom 2.184: SV106.3 SV106.4
M63  (2 unrouted)
  Top 2.184: SV306.8 SV306.7
  Bottom 2.184: SV106.7 SV106.8
M64  (2 unrouted)
  Top 2.184: SV306.10 SV306.9
  Bottom 2.184: SV106.9 SV106.10
N$1  (via drill 0.5 pad 1.68)
  other vias: 25.4,34.29
N$2  (via drill 0.5 pad 1.68)
  other vias: 17.78,26.67
N$3  (via drill 0.5 pad 1.68)
  other vias: 20.32,26.67
N$4  (via drill 0.5 pad 1.68)
  other vias: 27.94,26.67
N$5  (via drill 0.5 pad 1.68)
  other vias: 30.48,26.67
N$6  (via drill 0.5 pad 1.93)
  Top 0.61: R1.3 5.71,17.78 4.45,16.51 R2.1 4.45,12.7 5.08,12.06 C1.1
  other vias: 6.99,17.78 4.45,14.61
N$7  (via drill 0.5 pad 1.68)
  Top 1.27: R201.1 Q201.2
  other vias: 10.79,48.9 10.79,45.09
N$8  (via drill 0.5 pad 1.68)
  Top 0.406: 13.97,25.4 13.97,27.94 | 16.51,33.02 16.51,35.56
  Top 0.508: 13.97,21.59 13.97,24.13
  Top 0.61: 13.97,27.94 13.97,29.21 16.51,31.75 16.51,33.02 | 16.51,35.56 R202.2 | 13.97,24.13 13.97,25.4 | IC201.13 13.97,21.59
  other vias: 16.51,40.01
N$9  (via drill 0.5 pad 1.68)
  Top 0.61: IC201.1 12.7,15.24 10.79,17.14 R201.2
  other vias: 10.79,40.01
N$10  (via drill 0.5 pad 1.68)
  Top 0.508: IC201.4 16.51,16.51 17.78,17.78 IC201.10
  Top 0.61: IC201.10 17.78,24.13 IC203.7
  Bottom 0.813: R205.1 14.82,27.09 IC203.7
  other vias: 15.24,26.67
N$11  (via drill 0.5 pad 1.68)
  Bottom 1.27: R202.1 Q202.2
  other vias: 16.51,48.9 16.51,45.09
N$12  (via drill 0.5 pad 1.68)
  Top 0.813: R204.1 Q204.2
  other vias: 26.67,45.09 26.67,48.9
N$13  (via drill 0.5 pad 1.68)
  Top 0.813: R203.1 21.59,45.72 Q203.2
  other vias: 21.59,48.9 20.95,45.09
N$14  (via drill 0.5 pad 1.68)
  Top 0.406: 24.13,26.67 24.13,27.94 | 26.67,33.02 26.67,35.56
  Top 0.508: 24.13,21.59 24.13,24.13
  Top 0.61: IC202.13 24.13,21.59 | 24.13,24.13 24.13,26.67 | 24.13,27.94 24.13,29.21 26.67,31.75 26.67,33.02 | 26.67,35.56 R204.2
  other vias: 26.67,40.01
N$15  (via drill 0.5 pad 1.68)
  Top 0.508: IC202.4 26.67,16.51 27.94,17.78 IC202.10
  Top 0.61: IC202.10 27.94,24.13 IC204.7
  Bottom 0.813: R206.1 24.98,27.09 IC204.7
  other vias: 25.4,26.67
N$16  (via drill 0.5 pad 1.68)
  Top 0.406: 21.59,21.59 21.59,24.13 | 21.59,33.02 21.59,35.56 | 21.59,25.4 21.59,27.94
  Top 0.61: 21.59,21.59 21.59,16.51 22.86,15.24 IC202.1 | R203.2 20.95,38.73 21.59,38.1 21.59,35.56 | 21.59,27.94 21.59,33.02 | 21.59,24.13 21.59,25.4
  other vias: 20.95,40.01
N$17  (via drill 0.5 pad 1.93)
  Top 0.61: v6.35,25.4 4.45,23.5 4.45,21.59 5.71,20.32 R1.2
  Bottom 0.61: IC1.5 7.62,26.67 v6.35,25.4
  other vias: 6.99,20.32
N$18
  Bottom 0.61: IC1.1 IC1.2
N$19  (1 unrouted)
  Bottom 0.813: C202.1 25.53,34.42 IC204.2
N$20  (via drill 0.5 pad 2.18)
  Top 1.016: D3.C D2.C D6.C
  other vias: 13.34,64.14 15.88,64.14 18.41,64.14
N$21  (via drill 0.5 pad 3.81)
  other vias: 6.5,58.25
N$22  (via drill 0.5 pad 1.68)
  Top 0.61: R207.1 12.7,38.73 15.24,36.2 IC203.2
  Bottom 0.813: C201.1 15.37,34.42 IC203.2
  other vias: 12.7,40.01 15.24,34.29
N$23  (3 unrouted)
N$25  (via drill 0.5 pad 2.18)
  Top 1.016: D4.C D5.C D7.C
  other vias: 23.5,64.14 26.04,64.14 28.57,64.14
N$48  (via drill 0.5 pad 3.81)
  other vias: 143.5,58.25
N$49  (via drill 0.5 pad 3.81)
  other vias: 6.5,6.75
N$50  (via drill 0.5 pad 3.81)
  other vias: 143.5,6.75
TR_CLK  (via drill 0.6 pad 1.52)
  Top 0.508: IC201.3 15.24,17.14 v16.51,18.41 IC201.11 | IC202.3 25.4,17.14 v26.67,18.41 IC202.11
  Bottom 0.61: 16.51,19.05 10.79,19.05 | v16.51,18.41 16.51,19.05 | 16.51,19.05 26.67,19.05 | 26.67,19.05 v26.67,18.41 | 26.67,19.05 35.56,19.05
VCC  (2 unrouted)
  Bottom 2.184: 12.06,1.91 20.95,1.91 | 20.95,1.91 SV101.5 SV101.6 | 20.95,1.91 42.55,1.91 | 42.55,1.91 64.14,1.91 | 64.14,1.91 85.72,1.91 | 85.72,1.91 107.31,1.91 | 107.31,1.91 128.91,1.91 | 128.91,1.91 135.25,1.91 137.79,4.45 137.79,8.89 141.22,12.32 Q2.3 | SV106.6 SV106.5 128.91,1.91 | SV105.5 SV105.6 107.31,1.91 | SV104.5 SV104.6 85.72,1.91 | SV103.5 SV103.6 64.14,1.91 | SV102.5 SV102.6 42.55,1.91
VCC1  (via drill 0.5 pad 2.18)
  Top 0.813: D6.A 12.7,61.59 11.43,62.87 11.43,66.67 13.34,66.67 | D7.A 29.21,61.59 30.48,62.87 30.48,66.67
  Top 2.184: SV302.6 SV302.5 20.95,66.67 | 13.34,66.67 20.95,66.67 | 20.95,66.67 30.48,66.67 42.55,66.67 | 42.55,66.67 64.14,66.67 | 64.14,66.67 85.72,66.67 | 85.72,66.67 107.31,66.67 | 42.55,66.67 SV301.5 SV301.6 | 64.14,66.67 SV303.5 SV303.6 | 85.72,66.67 SV304.5 SV304.6 | 107.31,66.67 SV305.5 SV305.6 | 143.51,13.34 Q2.2 143.51,31.75 145.41,33.66 145.41,51.44 144.15,52.7 141.6,52.7 137.79,56.52 137.79,65.41 136.53,66.67 128.91,66.67 | 107.31,66.67 128.91,66.67 | SV306.6 SV306.5 128.91,66.67
  other vias: 13.34,61.59 28.57,61.59